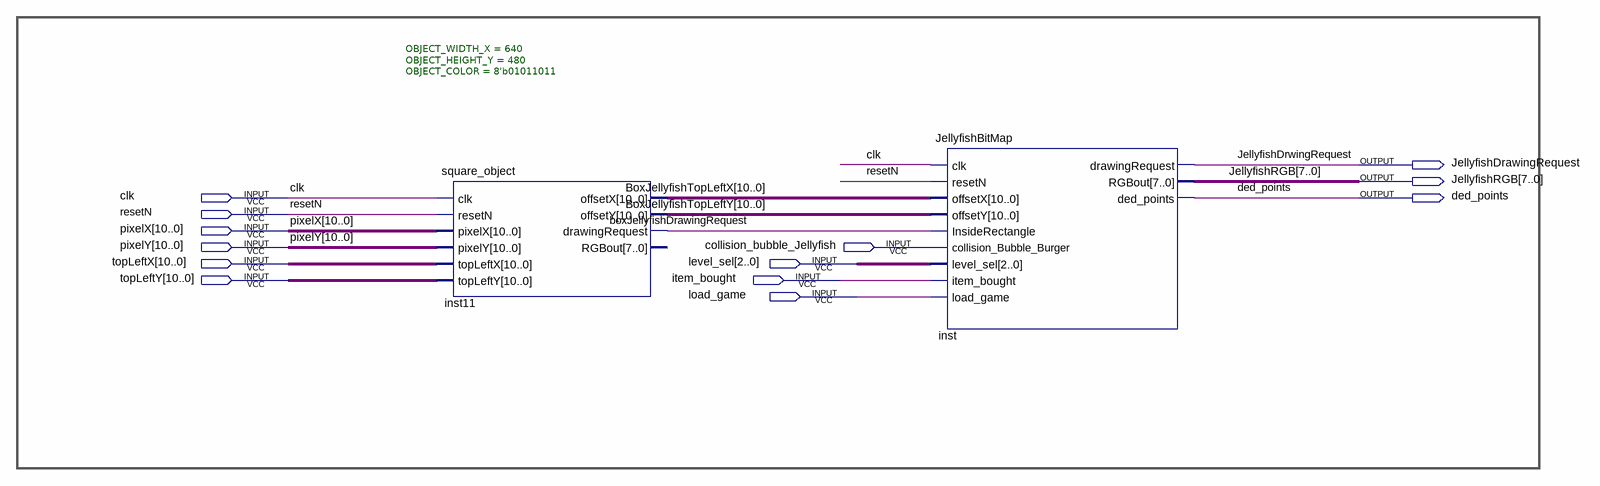
[diagram p0: schematic sheet]
// Quartus schematic JELLYFISH_DISPLAY.bdf as structural Verilog: 2 symbols, 13 pins
module JELLYFISH_DISPLAY (
  input  clk,
  input  resetN,
  input  [10:0] pixelX,
  input  [10:0] pixelY,
  input  collision_bubble_Jellyfish,
  input  [10:0] topLeftX,
  input  [2:0] level_sel,
  input  [10:0] topLeftY,
  input  item_bought,
  input  load_game,
  output JellyfishDrawingRequest,
  output [7:0] JellyfishRGB,
  output ded_points
);

  wire boxJellyfishDrawingRequest;
  wire [10:0] BoxJellyfishTopLeftX, BoxJellyfishTopLeftY;

  square_object #(.OBJECT_WIDTH_X(640), .OBJECT_HEIGHT_Y(480), .OBJECT_COLOR(8'b01011011)) inst11 (
    .clk(clk), .resetN(resetN), .pixelX(pixelX), .pixelY(pixelY), .topLeftX(topLeftX), .topLeftY(topLeftY),
    .offsetX(BoxJellyfishTopLeftX), .offsetY(BoxJellyfishTopLeftY),
    .drawingRequest(boxJellyfishDrawingRequest));  // open: RGBout
  JellyfishBitMap inst (
    .clk(clk), .resetN(resetN), .offsetX(BoxJellyfishTopLeftX), .offsetY(BoxJellyfishTopLeftY),
    .InsideRectangle(boxJellyfishDrawingRequest), .collision_Bubble_Burger(collision_bubble_Jellyfish),
    .level_sel(level_sel), .item_bought(item_bought), .load_game(load_game),
    .drawingRequest(JellyfishDrawingRequest), .RGBout(JellyfishRGB), .ded_points(ded_points));

  // Other names for the same wires on the sheet: JellyfishDrwingRequest = JellyfishDrawingRequest
endmodule
